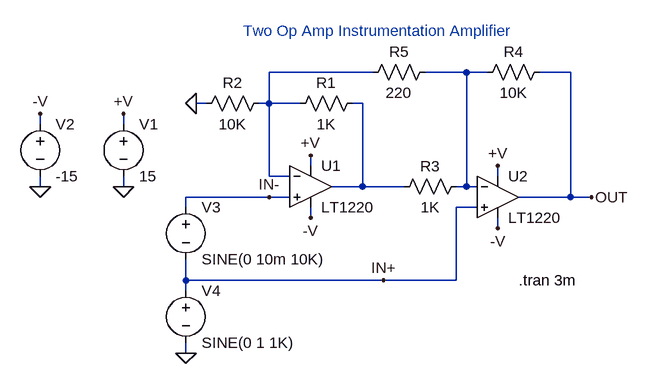
[diagram p0: schematic LT1220.asc]
LT1220.asc, the LTspice schematic file:
Version 4
SHEET 1 896 680
WIRE 288 64 128 64
WIRE 432 64 368 64
WIRE 464 64 432 64
WIRE 592 64 544 64
WIRE 32 112 16 112
WIRE 128 112 128 64
WIRE 128 112 112 112
WIRE 176 112 128 112
WIRE 272 112 256 112
WIRE -224 144 -224 128
WIRE -96 144 -96 128
WIRE 192 208 192 192
WIRE 128 224 128 112
WIRE 160 224 128 224
WIRE 480 224 480 208
WIRE -224 240 -224 224
WIRE -96 240 -96 224
WIRE 272 240 272 112
WIRE 272 240 224 240
WIRE 336 240 272 240
WIRE 432 240 432 64
WIRE 432 240 416 240
WIRE 448 240 432 240
WIRE 128 256 0 256
WIRE 160 256 128 256
WIRE 592 256 592 64
WIRE 592 256 512 256
WIRE 624 256 592 256
WIRE 0 272 0 256
WIRE 448 272 416 272
WIRE 192 288 192 272
WIRE 480 304 480 288
WIRE 0 384 0 352
WIRE 304 384 0 384
WIRE 416 384 416 272
WIRE 416 384 304 384
WIRE 0 400 0 384
WIRE 0 496 0 480
FLAG -96 240 0
FLAG 192 192 +V
FLAG -96 128 +V
FLAG 192 288 -V
FLAG -224 240 0
FLAG -224 128 -V
FLAG 16 112 0
FLAG 0 496 0
FLAG 480 208 +V
FLAG 480 304 -V
FLAG 128 256 IN-
FLAG 304 384 IN+
FLAG 624 256 OUT
SYMBOL voltage -96 128 R0
SYMATTR InstName V1
SYMATTR Value 15
SYMBOL voltage -224 128 R0
SYMATTR InstName V2
SYMATTR Value -15
SYMBOL res 272 96 R90
WINDOW 0 0 56 VBottom 2
WINDOW 3 32 56 VTop 2
SYMATTR InstName R1
SYMATTR Value 1K
SYMBOL res 128 96 R90
WINDOW 0 0 56 VBottom 2
WINDOW 3 32 56 VTop 2
SYMATTR InstName R2
SYMATTR Value 10K
SYMBOL voltage 0 256 R0
SYMATTR InstName V3
SYMATTR Value SINE(0 10m 10K)
SYMBOL opamps\\LT1220 192 176 R0
SYMATTR InstName U1
SYMBOL opamps\\LT1220 480 192 R0
SYMATTR InstName U2
SYMBOL res 432 224 R90
WINDOW 0 0 56 VBottom 2
WINDOW 3 32 56 VTop 2
SYMATTR InstName R3
SYMATTR Value 1K
SYMBOL res 560 48 R90
WINDOW 0 0 56 VBottom 2
WINDOW 3 32 56 VTop 2
SYMATTR InstName R4
SYMATTR Value 10K
SYMBOL res 384 48 R90
WINDOW 0 0 56 VBottom 2
WINDOW 3 32 56 VTop 2
SYMATTR InstName R5
SYMATTR Value 220
SYMBOL voltage 0 384 R0
SYMATTR InstName V4
SYMATTR Value SINE(0 1 1K)
TEXT 512 384 Left 2 !.tran 3m
TEXT 296 16 Bottom 2 ;Two Op Amp Instrumentation Amplifier

The netlist it stands for:
* LT1220.asc
V1 +V 0 15
V2 -V 0 -15
R1 N003 N001 1K
R2 N001 0 10K
V3 IN- IN+ SINE(0 10m 10K)
XU1 IN- N001 +V -V N003 LT1220  ; pins In+ In- V+ V- OUT
XU2 IN+ N002 +V -V OUT LT1220  ; pins In+ In- V+ V- OUT
R3 N002 N003 1K
R4 OUT N002 10K
R5 N002 N001 220
V4 IN+ 0 SINE(0 1 1K)
.tran 3m
* Two Op Amp Instrumentation Amplifier
.backanno
.end